# Altium schematic sheet GPIOs.SchDoc: Evaluation Board 3.2
size A3; Organization: Toradex AG; Address1: Altsagenstrasse 5; Address2: Horw; Address3: 6048; Address4: Switzerland; DocumentNumber: 9; Revision: V3.2; SheetNumber: 9; SheetTotal: 23; PageSetup: Record=PageOptions|CenterHorizontal=True|CenterVertical=True|PrintScale=0.73|XCorrection=1.00|YCorrection=1.00|PrintKind=0|BorderSize=5000000|LeftOffset=0|BottomOffset=0|Orientation=2|PaperLength=1000|PaperWidth=1000|Scale=100|PaperSource=7|PrintQuality=-4|MediaType=1|DitherType=10|PaperKind=A4|PrintScaleMode=1
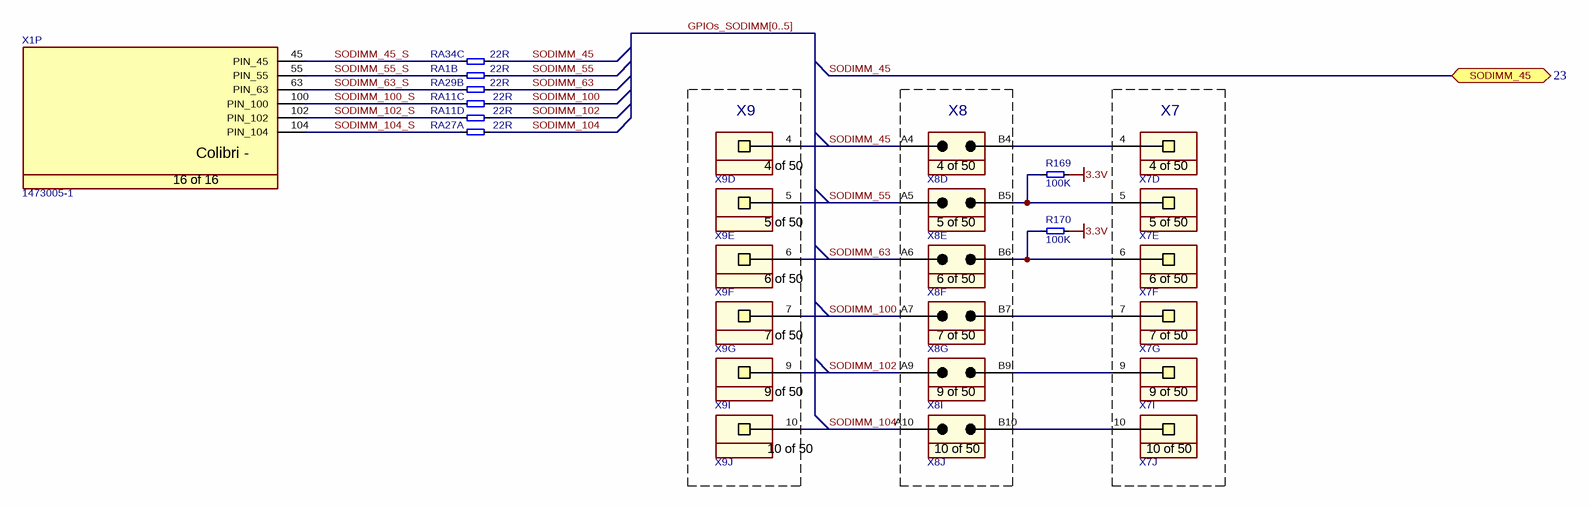
[diagram p0: GPIOs.SchDoc]

## Parts
R169  100K  [T_RESC0603X30N]
R170  100K  [T_RESC0603X30N]
RA1  22R  [T_Resistor_Array_X4]  (part B of 4)
RA11  22R  [T_Resistor_Array_X4]  (parts C,D of 4)
RA27  22R  [T_Resistor_Array_X4]  (part A of 4)
RA29  22R  [T_Resistor_Array_X4]  (part B of 4)
RA34  22R  [T_Resistor_Array_X4]  (part C of 4)
X1  Manufacturer Part No.: 1473005-1  [T_Tyco_1473005-1]  (hidden comment: CON-Tyco-1473005-1-200-0.6mm)  (part P of 16)
X7  SSW-110-01-G-S  [T_Samtec_SSW-110-01-G-S]  (value not drawn)  (parts D,E,F,G,I,J of 50)
X8  TSW-110-07-G-D  [T_Samtec_TSW-110-07-G-D]  (value not drawn)  (parts D,E,F,G,I,J of 50)
X9  SSW-110-01-G-S  [T_Samtec_SSW-110-01-G-S]  (value not drawn)  (parts D,E,F,G,I,J of 50)

## Blocks framed on the sheet
X9: X9
X8: X8
X7: X7

## Ports
SODIMM_45 (bidir, see 23)

## Nets
3.3V: R169.2 R170.2
SODIMM_45: RA34.7 X8.A4 X9.4 ; port SODIMM_45
SODIMM_45_S: RA34.3 X1.45(PIN_45)
SODIMM_55: RA1.6 X8.A5 X9.5
SODIMM_55_S: RA1.2 X1.55(PIN_55)
SODIMM_63: RA29.6 X8.A6 X9.6
SODIMM_63_S: RA29.2 X1.63(PIN_63)
SODIMM_100: RA11.7 X8.A7 X9.7
SODIMM_100_S: RA11.3 X1.100(PIN_100)
SODIMM_102: RA11.8 X8.A9 X9.9
SODIMM_102_S: RA11.4 X1.102(PIN_102)
SODIMM_104: RA27.5 X8.A10 X9.10
SODIMM_104_S: RA27.1 X1.104(PIN_104)
NetR169_1: R169.1 X7.5 X8.B5
NetR170_1: R170.1 X7.6 X8.B6
NetX7_4: X7.4 X8.B4
NetX7_7: X7.7 X8.B7
NetX7_9: X7.9 X8.B9
NetX7_10: X7.10 X8.B10

## Buses and harness runs
bus GPIOs_SODIMM[0..5]

## Notes on the sheet
- Title
- Size:
- Date:
- A3
- Number:
- Time:
- Revision:
- Sheet
- of
- File:
- (in symbol CON-Samtec-SSW-110-01-G-S, part D) 4 of 50
- (in symbol CON-Samtec-SSW-110-01-G-S, part E) 5 of 50
- (in symbol CON-Samtec-SSW-110-01-G-S, part F) 6 of 50
- (in symbol CON-Samtec-SSW-110-01-G-S, part G) 7 of 50
- (in symbol CON-Samtec-SSW-110-01-G-S, part I) 9 of 50
- (in symbol CON-Samtec-SSW-110-01-G-S, part J) 10 of 50
- (in symbol CON-Samtec-TSW-110-07-G-D, part D) 4 of 50
- (in symbol CON-Samtec-TSW-110-07-G-D, part E) 5 of 50
- (in symbol CON-Samtec-TSW-110-07-G-D, part F) 6 of 50
- (in symbol CON-Samtec-TSW-110-07-G-D, part G) 7 of 50
- (in symbol CON-Samtec-TSW-110-07-G-D, part I) 9 of 50
- (in symbol CON-Samtec-TSW-110-07-G-D, part J) 10 of 50
- (in symbol CON-Tyco-1473005-1-200-0.6mm, part P) Colibri -; 16 of 16

## Library data of the parts
R169 R170 = R-100KR-63mW-5%-0603: Resistor 100 Kohm 63mW 5% 0603; Value: 100KR; Rating: 63mW; Tolerance: 5%
RA1 RA11 RA27 RA29 RA34 = RA-22R-63mW-5%-1206-div: Resistor Array 22 R 63mW 5% 1206; Tolerance: 5%; Power Dissipation: 63mW; Value: 22R
X1 = CON-Tyco-1473005-1-200-0.6mm: SODIMM Connector; Manufacturer Name: Tyco; No. of ways: 200
X7 X9 = CON-Samtec-SSW-110-01-G-S: Header 1x50 pin 2.54mm pitch; Manufacturer Name: Samtec; Pitch: 2.54mm; No. of ways: 1x50; Manufacturer Part No.: SSW-110-01-G-S
X8 = CON-Samtec-TSW-110-07-G-D: Header 2x50 pin 2.54mm pitch; Manufacturer Name: Samtec; Pitch: 2.54mm; No. of ways: 2x50; Manufacturer Part No.: TSW-110-07-G-D